# EAGLE design Extern (EAGLE 9.2.0)
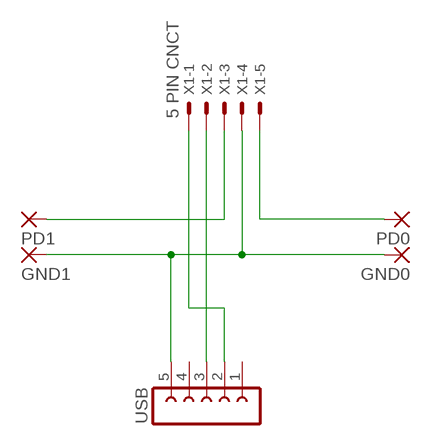
[diagram p0: schematic, sheet 1]

## Parts
GND0  SMD5  [SMD2,54-5,08]
GND1  SMD5  [SMD2,54-5,08]
PD0  SMD5  [SMD2,54-5,08]
PD1  SMD5  [SMD2,54-5,08]
USB  FE05-1  [FE05-1]
X1  5 PIN CNCT  JST-XH-05-PIN-ROUND-PAD  [JST-XH-05-PACKAGE-ROUND-PAD]

## Nets
D+: USB.3 X1.2
D-: USB.2 X1.1
GND: GND0.1(P) GND1.1(P) USB.5 X1.4
N$1: PD0.1(P) X1.5
PD1: PD1.1(P) X1.3
Unconnected: USB.1 USB.4

## Library data of the parts
GND0 GND1 PD0 PD1 = wirepad:SMD5: SMD PAD
USB = con-lsta:FE05-1: FEMALE HEADER; OC_FARNELL: unknown; OC_NEWARK: unknown
X1 = Rembrandt Electronics - JST XH Connectors v1-0:JST-XH-05-PIN: JST XH Connector 2 Pin Wire to board connector. Pitch: 2,54 mm, (0.100") Number of pins: 5 Created by Rembrandt Electronics www.rembrandtelectronics.com

## Board
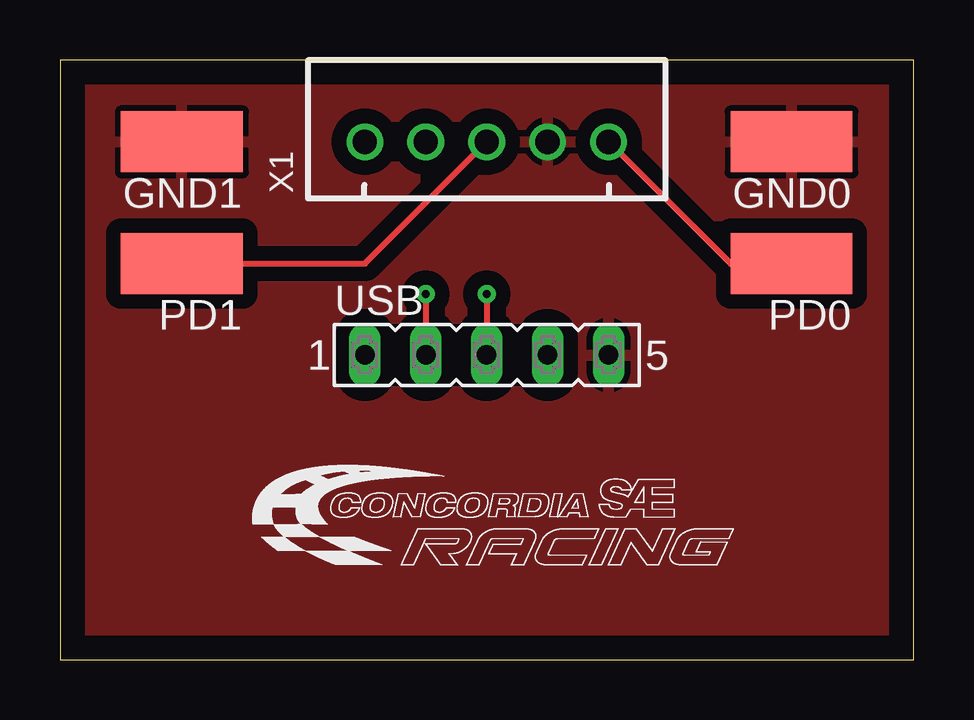
[diagram p1: board, top side]
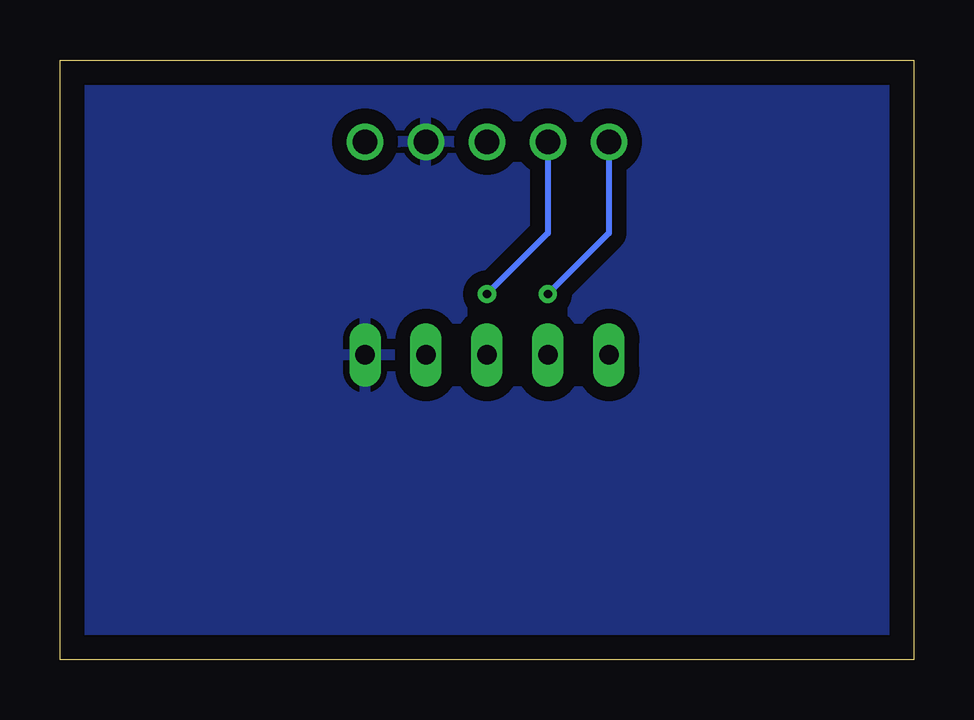
[diagram p2: board, bottom side, seen from below]

Size 35.57 x 25 mm. Coordinates in mm from the lower left corner, seen from the top.
Outline: 0,0 35.57,0 35.57,25 0,25 0,0
Copper layers (1*16): Top 0.035mm / dielectric 1.5mm / Bottom 0.035mm
Design rules "jlcpcb": minimum track width 3.5mil, minimum drill 0.2mm, track to track 3.5mil, track to pad 3.5mil, pad to pad 3.5mil, via to via 3.5mil, smd to smd 0mil, copper to edge 40mil, drill to drill 6mil, minimum pad ring 10mil, minimum via ring 8mil, stop-mask expansion 4mil, vias tented up to drill 0mil, thermal gap 10mil

### Footprints (pad centres in the part's own frame; a part is rotated, then mirrored left to right if it is on the bottom)
SMD2,54-5,08 = smd 2.54 x 5.08: 1 0,0
FE05-1 = drill 0.813 long: 1 -5.08,0; 2 -2.54,0; 3 0,0; 4 2.54,0; 5 5.08,0
JST-XH-05-PACKAGE-ROUND-PAD = drill 1.016: 1 -5.08,0; 2 -2.54,0; 3 0,0; 4 2.54,0; 5 5.08,0

### Placement (x,y rotation side)
GND0  30.48,21.59 90 top
GND1  5.08,21.59 90 top
PD0  30.48,16.51 90 top
PD1  5.08,16.51 90 top
USB  17.78,12.7 0 top
X1  17.78,21.59 0 top

### Tracks (layer width: path | path; a pad name or v marks a point on that pad's centre or on a via)
D+  (via drill 0.35)
  Top 0.254: v17.78,15.24 USB.3
  Bottom 0.254: X1.2 15.24,17.78 v17.78,15.24
D-  (via drill 0.35)
  Top 0.254: v15.24,15.24 USB.2
  Bottom 0.254: X1.1 12.7,17.78 v15.24,15.24
GND
  pour Top (isolate 0.61): -2.54,27.94 -2.54,-2.54 38.1,-2.54 38.1,27.94
  pour Bottom (isolate 0.61): -5.08,30.48 -5.08,-5.08 41.91,-5.08 41.91,30.48
N$1
  Top 0.254: PD0.1 27.94,16.51 X1.5
PD1
  Top 0.254: PD1.1 12.7,16.51 X1.3